# Altium project Sintetizador_BA_Analog.PrjPCB
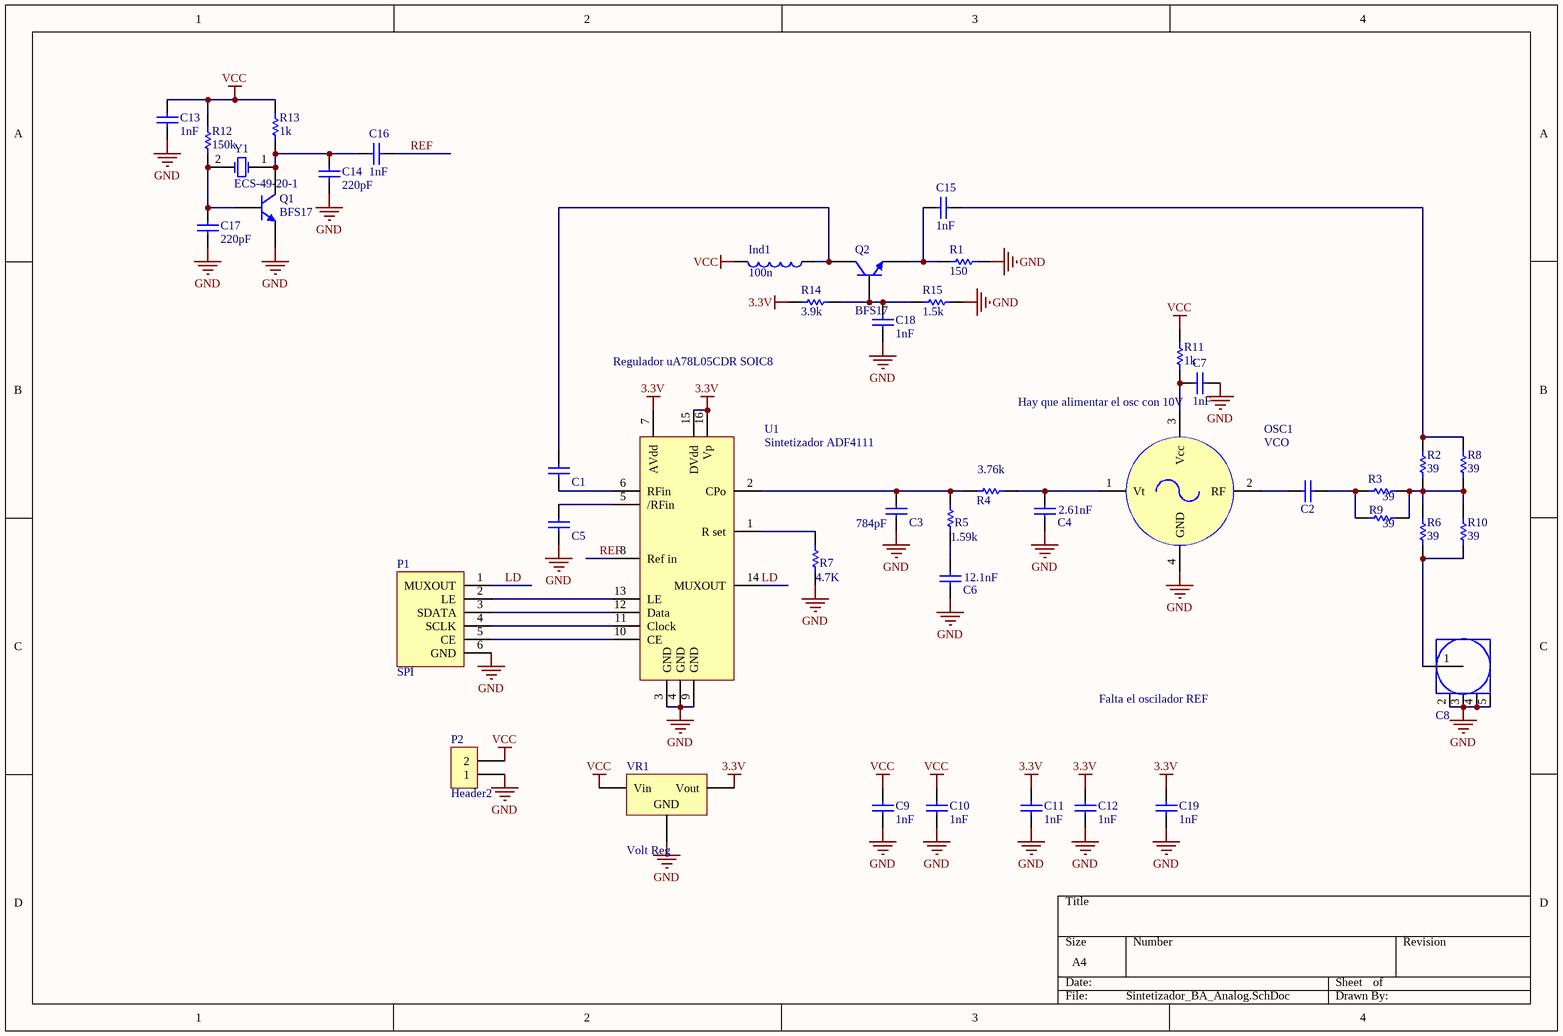
[diagram p0: Sintetizador_BA_Analog.SchDoc]
1 sheet, 43 parts. Net scope: global (net labels, ports and power ports of the same name join across sheets).
Board file: SintetivadorV00.PcbDoc

## Sheet Sintetizador_BA_Analog.SchDoc
size A4

### Parts
C1  Capacitor  [0805_CAP]  (value not drawn)
C2  Capacitor  [0805_CAP]  (value not drawn)
C3  value 784pF  [0805_CAP]  (hidden comment: Capacitor)
C4  value 2.61nF  [0805_CAP]  (hidden comment: Capacitor)
C5  Capacitor  [0805_CAP]  (value not drawn)
C6  value 12.1nF  [0805_CAP]  (hidden comment: Capacitor)
C7  value 1nF  [0805_CAP]  (hidden comment: Capacitor)
C8  SMA  [SMAL2]  (value not drawn)
C9  value 1nF  [0805_CAP]  (hidden comment: Capacitor)
C10  value 1nF  [0805_CAP]  (hidden comment: Capacitor)
C11  value 1nF  [0805_CAP]  (hidden comment: Capacitor)
C12  value 1nF  [0805_CAP]  (hidden comment: Capacitor)
C13  value 1nF  [0805_CAP]  (hidden comment: Capacitor)
C14  value 220pF  [0805_CAP]  (hidden comment: Capacitor)
C15  value 1nF  [0805_CAP]  (hidden comment: Capacitor)
C16  value 1nF  [0805_CAP]  (hidden comment: Capacitor)
C17  value 220pF  [0805_CAP]  (hidden comment: Capacitor)
C18  value 1nF  [0805_CAP]  (hidden comment: Capacitor)
C19  value 1nF  [0805_CAP]  (hidden comment: Capacitor)
Ind1  Valor: 100n  [NTH12_2]  (hidden comment: Ind2)
OSC1  VCO  [V140MC03]
P1  SPI  [HeaderHx6]
P2  Header2  [HeaderHx2]
Q1  BFS17  [SOT23]
Q2  BFS17  [SOT23]
R1  value 150  [0805_RES]  (hidden comment: Resistor)
R2  value 39  [0805_RES]  (hidden comment: Resistor)
R3  value 39  [0805_RES]  (hidden comment: Resistor)
R4  value 3.76k  [0805_RES]  (hidden comment: Resistor)
R5  value 1.59k  [0805_RES]  (hidden comment: Resistor)
R6  value 39  [0805_RES]  (hidden comment: Resistor)
R7  value 4.7K  [0805_RES]  (hidden comment: Resistor)
R8  value 39  [0805_RES]  (hidden comment: Resistor)
R9  value 39  [0805_RES]  (hidden comment: Resistor)
R10  value 39  [0805_RES]  (hidden comment: Resistor)
R11  value 1k  [0805_RES]  (hidden comment: Resistor)
R12  value 150k  [0805_RES]  (hidden comment: Resistor)
R13  value 1k  [0805_RES]  (hidden comment: Resistor)
R14  value 3.9k  [0805_RES]  (hidden comment: Resistor)
R15  value 1.5k  [0805_RES]  (hidden comment: Resistor)
U1  Sintetizador ADF4111  [TSSOP16]
VR1  Volt Reg  [SOT-223 - M3]
Y1  ECS-49-20-1  [HC-49U]

### Nets
3.3V: C11.2 C12.2 C19.2 R14.1 U1.7(AVdd) U1.15(DVdd) U1.16(Vp) VR1.3(Vout)
GND: C3.1 C4.1 C5.1 C6.1 C7.1 C8.2(GND) C8.3(GND) C8.4(GND) C8.5(GND) C9.1 C10.1 C11.1 C12.1 C13.1 C14.2 C17.1 C18.1 C19.1 OSC1.4(GND) P1.6(GND) P2.1 Q1.2(E) R1.2 R7.2 R15.2 U1.3(GND) U1.4(GND) U1.9(GND) VR1.2(GND)
VCC: C9.2 C10.2 C13.2 Ind1.2 P2.2 R11.1 R12.1 R13.1 VR1.1(Vin)
LD: P1.1(MUXOUT) U1.14(MUXOUT)
REF: C16.1 U1.8(Ref_in)
NetC1_1: C1.1 U1.6(RFin)
NetC1_2: C1.2 Ind1.1 Q2.3(C)
NetC2_1: C2.1 R3.1 R9.1
NetC2_2: C2.2 OSC1.2(RF)
NetC3_2: C3.2 R4.1 R5.1 U1.2(CPo)
NetC4_2: C4.2 OSC1.1(Vt) R4.2
NetC5_2: C5.2 U1.5(/RFin)
NetC6_2: C6.2 R5.2
NetC7_2: C7.2 OSC1.3(Vcc) R11.2
NetC8_1: C8.1(RF) R6.1 R10.1
NetC14_1: C14.1 C16.2 Q1.3(C) R13.2 Y1.1(OSC1)
NetC15_1: C15.1 Q2.2(E) R1.1
NetC15_2: C15.2 R2.2 R8.2
NetC17_2: C17.2 Q1.1(B) R12.2 Y1.2(OSC2)
NetC18_2: C18.2 Q2.1(B) R14.2 R15.1
NetP1_2: P1.2(LE) U1.13(LE)
NetP1_3: P1.3(SDATA) U1.12(Data)
NetP1_4: P1.4(SCLK) U1.11(Clock)
NetP1_5: P1.5(CE) U1.10(CE)
NetR2_1: R2.1 R3.2 R6.2 R8.1 R9.2 R10.2
NetR7_1: R7.1 U1.1(R_set)

### Notes on the sheet
- Regulador uA78L05CDR SOIC8
- (near C7) Hay que alimentar el osc con 10V
- Falta el oscilador REF

### Library data of the parts
C1-C7 C9-C19 = Cap
OSC1 = V140MC03
P1 = ADF_SPI_GND
Q1 Q2 = BFS17: NPN 1 GHz Wideband Transistor; Published: 17-Sep-2003; LatestRevisionDate: 12-Dec-2006; LatestRevisionNote: IPC-7351 Footprint Added.; DatasheetVersion: Sep-1995; PackageVersion: May-1999; PackageReference: SOT23; Publisher: Altium Limited; PackageDescription: 3-Pin SOT-23 Package 0.95 mm Pitch, 2.3 mm Lead Span; ComponentLink1Description: Manufacturer Link; ComponentLink1URL: http://www.semiconductors.philips.com/; ComponentLink2Description: Datasheet; ComponentLink2URL: http://www.semiconductors.philips.com/acrobat/datasheets/BFS17_2.pdf
R1-R15 = Res
U1 = ADF4111
VR1 = Volt Reg: Voltage Regulator; pin to pad: 1>3 2>1 3>2; Published: 24-Mar-1999; LatestRevisionDate: 29-May-2009; LatestRevisionNote: IPC-7351 Footprint Added.; PackageReference: D2PAK; Publisher: Altium Limited; PackageDescription: 3-Pin Transistor Outline Package 2.54 mm Pitch, 15.1 mm Lead Span
Y1 = ECS-49-20-1: Crystal Oscillator; Published: 17-Jul-2002; DatasheetDocument: 18-Apr-2000; PackageReference: HC-49U; Publisher: Altium Limited; ComponentLink1Description: Manufacturer Link; ComponentLink1URL: http://www.ecsxtal.com/; ComponentLink2Description: Datasheet; ComponentLink2URL: http://www.ecsxtal.com/pdf2/HC49U.PDF